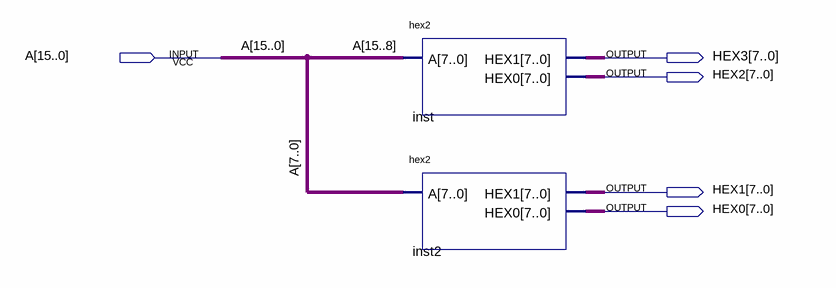
[diagram p0: schematic sheet]
// Quartus schematic hex4.bdf as structural Verilog: 2 symbols, 5 pins
module hex4 (
  input  [15:0] A,
  output [7:0] HEX3,
  output [7:0] HEX2,
  output [7:0] HEX1,
  output [7:0] HEX0
);

  hex2 inst (.A(A[15:8]), .HEX1(HEX3), .HEX0(HEX2));
  hex2 inst2 (.A(A[7:0]), .HEX1(HEX1), .HEX0(HEX0));
endmodule
